# EAGLE design Qwiic Mux (EAGLE 9.6.0)
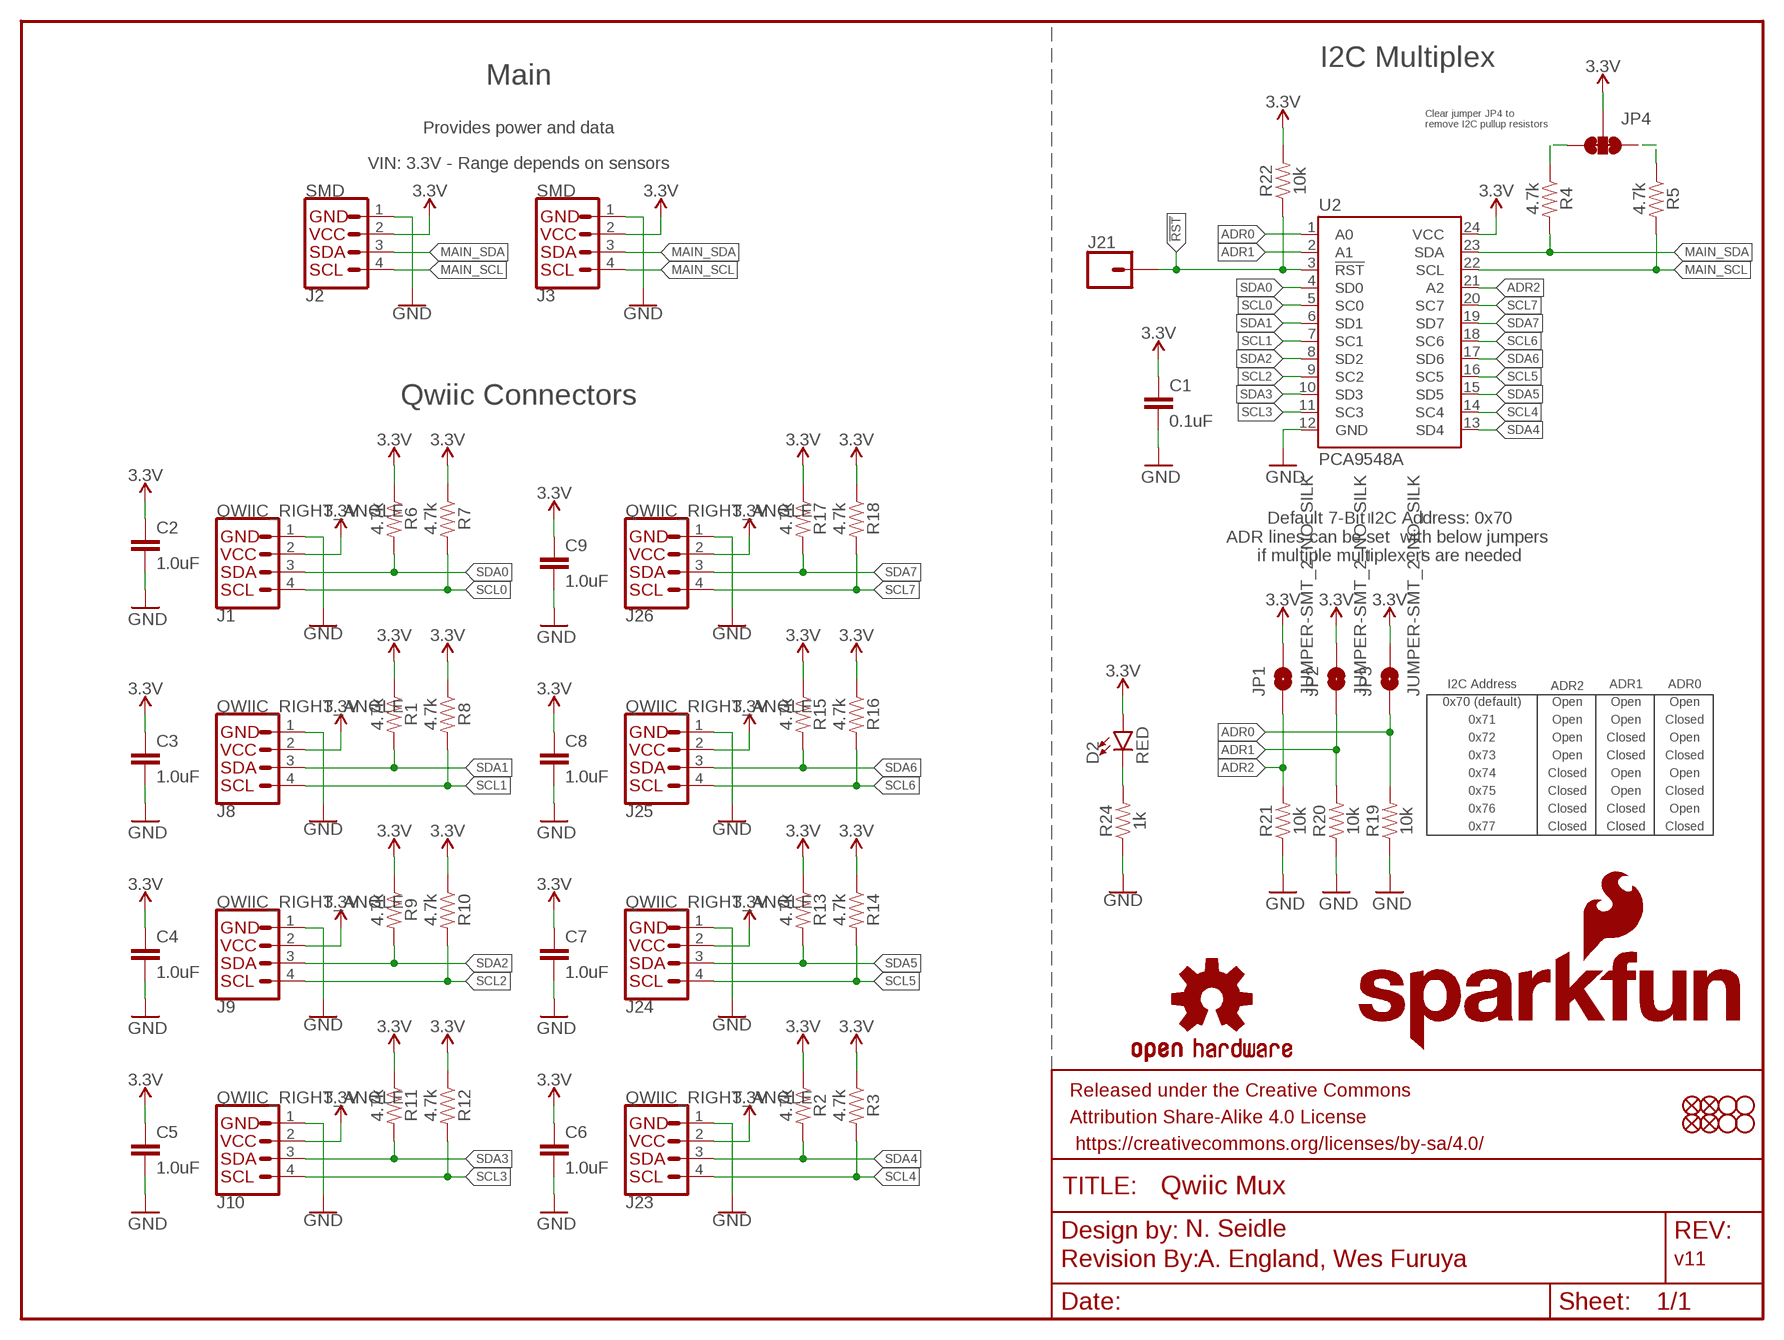
[diagram p0: schematic, sheet 1]

## Parts
C1  0.1uF  0.1UF-0603-25V-(+80/-20%)  [0603]
C2  1.0uF  1.0UF-0603-16V-10%  [0603]
C3  1.0uF  1.0UF-0603-16V-10%  [0603]
C4  1.0uF  1.0UF-0603-16V-10%  [0603]
C5  1.0uF  1.0UF-0603-16V-10%  [0603]
C6  1.0uF  1.0UF-0603-16V-10%  [0603]
C7  1.0uF  1.0UF-0603-16V-10%  [0603]
C8  1.0uF  1.0UF-0603-16V-10%  [0603]
C9  1.0uF  1.0UF-0603-16V-10%  [0603]
D2  RED  LED-RED0603  [LED-0603]
FD1  FIDUCIAL1X2  [FIDUCIAL-1X2]
FD2  FIDUCIAL1X2  [FIDUCIAL-1X2]
FD3  FIDUCIAL1X2  [FIDUCIAL-1X2]
FD4  FIDUCIAL1X2  [FIDUCIAL-1X2]
FRAME1  FRAME-LETTER  [CREATIVE_COMMONS]
H1  STAND-OFF  [STAND-OFF]
H2  STAND-OFF  [STAND-OFF]
H3  STAND-OFF  [STAND-OFF]
H4  STAND-OFF  [STAND-OFF]
J1  QWIIC_RIGHT_ANGLE  QWIIC_CONNECTORJS-1MM  [JST04_1MM_RA]
J2  SMD  I2C_STANDARDJS-1MM  [1X04_1MM_RA]
J3  SMD  I2C_STANDARDJS-1MM  [1X04_1MM_RA]
J8  QWIIC_RIGHT_ANGLE  QWIIC_CONNECTORJS-1MM  [JST04_1MM_RA]
J9  QWIIC_RIGHT_ANGLE  QWIIC_CONNECTORJS-1MM  [JST04_1MM_RA]
J10  QWIIC_RIGHT_ANGLE  QWIIC_CONNECTORJS-1MM  [JST04_1MM_RA]
J21  CONN_01PTH_NO_SILK_YES_STOP  [1X01_NO_SILK]
J23  QWIIC_RIGHT_ANGLE  QWIIC_CONNECTORJS-1MM  [JST04_1MM_RA]
J24  QWIIC_RIGHT_ANGLE  QWIIC_CONNECTORJS-1MM  [JST04_1MM_RA]
J25  QWIIC_RIGHT_ANGLE  QWIIC_CONNECTORJS-1MM  [JST04_1MM_RA]
J26  QWIIC_RIGHT_ANGLE  QWIIC_CONNECTORJS-1MM  [JST04_1MM_RA]
JP1  JUMPER-SMT_2_NO_SILK  [SMT-JUMPER_2_NO_SILK]
JP2  JUMPER-SMT_2_NO_SILK  [SMT-JUMPER_2_NO_SILK]
JP3  JUMPER-SMT_2_NO_SILK  [SMT-JUMPER_2_NO_SILK]
JP4  JUMPER-SMT_3_2-NC_TRACE_SILK  [SMT-JUMPER_3_2-NC_TRACE_SILK]
LOGO1  OSHW-LOGOMINI  [OSHW-LOGO-MINI]
LOGO2  REVISION  [REVISION]
R1  4.7k  4.7KOHM-0603-1/10W-1%  [0603]
R2  4.7k  4.7KOHM-0603-1/10W-1%  [0603]
R3  4.7k  4.7KOHM-0603-1/10W-1%  [0603]
R4  4.7k  4.7KOHM-0603-1/10W-1%  [0603]
R5  4.7k  4.7KOHM-0603-1/10W-1%  [0603]
R6  4.7k  4.7KOHM-0603-1/10W-1%  [0603]
R7  4.7k  4.7KOHM-0603-1/10W-1%  [0603]
R8  4.7k  4.7KOHM-0603-1/10W-1%  [0603]
R9  4.7k  4.7KOHM-0603-1/10W-1%  [0603]
R10  4.7k  4.7KOHM-0603-1/10W-1%  [0603]
R11  4.7k  4.7KOHM-0603-1/10W-1%  [0603]
R12  4.7k  4.7KOHM-0603-1/10W-1%  [0603]
R13  4.7k  4.7KOHM-0603-1/10W-1%  [0603]
R14  4.7k  4.7KOHM-0603-1/10W-1%  [0603]
R15  4.7k  4.7KOHM-0603-1/10W-1%  [0603]
R16  4.7k  4.7KOHM-0603-1/10W-1%  [0603]
R17  4.7k  4.7KOHM-0603-1/10W-1%  [0603]
R18  4.7k  4.7KOHM-0603-1/10W-1%  [0603]
R19  10k  10KOHM-0603-1/10W-1%  [0603]
R20  10k  10KOHM-0603-1/10W-1%  [0603]
R21  10k  10KOHM-0603-1/10W-1%  [0603]
R22  10k  10KOHM-0603-1/10W-1%  [0603]
R24  1k  1KOHM-0603-1/10W-1%  [0603]
U2  PCA9548A  [TSSOP28]
U$1  SFE_LOGO_NAME_FLAME.1_INCH  [SFE_LOGO_NAME_FLAME_.1]
U$2  SFE_LOGO_NAME_FLAME.1_INCH  [SFE_LOGO_NAME_FLAME_.1]

## Nets
3.3V: C1.1 C2.1 C3.1 C4.1 C5.1 C6.1 C7.1 C8.1 C9.1 D2.A J1.2 J2.2(VCC) J3.2(VCC) J8.2 J9.2 J10.2 J23.2 J24.2 J25.2 J26.2 JP1.2 JP2.2 JP3.2 JP4.2 R1.1 R2.1 R3.1 R6.1 R7.1 R8.1 R9.1 R10.1 R11.1 R12.1 R13.1 R14.1 R15.1 R16.1 R17.1 R18.1 R22.2 U2.24(VCC)
!RST: J21.1 R22.1 U2.3(!RST)
ADR0: JP3.1 R19.2 U2.1(A0)
ADR1: JP2.1 R20.2 U2.2(A1)
ADR2: JP1.1 R21.2 U2.21(A2)
GND [vcc]: C1.2 C2.2 C3.2 C4.2 C5.2 C6.2 C7.2 C8.2 C9.2 J1.1 J2.1(GND) J3.1(GND) J8.1 J9.1 J10.1 J23.1 J24.1 J25.1 J26.1 R19.1 R20.1 R21.1 R24.1 U2.12(GND)
MAIN_SCL: J2.4(SCL) J3.4(SCL) R5.2 U2.22(SCL)
MAIN_SDA: J2.3(SDA) J3.3(SDA) R4.2 U2.23(SDA)
N$1: D2.C R24.2
N$2: JP4.3 R4.1
N$3: JP4.1 R5.1
SCL0: J1.4 R7.2 U2.5(SC0)
SCL1: J8.4 R8.2 U2.7(SC1)
SCL2: J9.4 R10.2 U2.9(SC2)
SCL3: J10.4 R12.2 U2.11(SC3)
SCL4: J23.4 R3.2 U2.14(SC4)
SCL5: J24.4 R14.2 U2.16(SC5)
SCL6: J25.4 R16.2 U2.18(SC6)
SCL7: J26.4 R18.2 U2.20(SC7)
SDA0: J1.3 R6.2 U2.4(SD0)
SDA1: J8.3 R1.2 U2.6(SD1)
SDA2: J9.3 R9.2 U2.8(SD2)
SDA3: J10.3 R11.2 U2.10(SD3)
SDA4: J23.3 R2.2 U2.13(SD4)
SDA5: J24.3 R13.2 U2.15(SD5)
SDA6: J25.3 R15.2 U2.17(SD6)
SDA7: J26.3 R17.2 U2.19(SD7)

## Notes on the sheet
- I2C Multiplex
- Main
- Provides power and data
- Clear jumper JP4 to 
  remove I2C pullup resistors
- VIN: 3.3V - Range depends on sensors
- Qwiic Connectors
- Default 7-Bit I2C Address: 0x70
  ADR lines can be set  with below jumpers 
  if multiple multiplexers are needed
- I2C Address | ADR2 | ADR1 | ADR0
- 0x70 (default) | Open | Open | Open
- 0x71 | Open | Open | Closed
- 0x72 | Open | Closed | Open
- 0x73 | Open | Closed | Closed
- 0x74 | Closed | Open | Open
- 0x75 | Closed | Open | Closed
- 0x76 | Closed | Closed | Open
- 0x77 | Closed | Closed | Closed
- N. Seidle
- A. England, Wes Furuya | v11

## Library data of the parts
C1 = SparkFun-Capacitors:0.1UF: 0.1µF ceramic capacitors A capacitor is a passive two-terminal electrical component used to store electrical energy temporarily in an electric field.; PROD_ID: CAP-00810
C2-C9 = SparkFun-Capacitors:1.0UF: 1µF ceramic capacitors A capacitor is a passive two-terminal electrical component used to store electrical energy temporarily in an electric field.; PROD_ID: CAP-00868
D2 = SparkFun-LED:LED-RED: Red SMD LED Used in manufacturing of most products at SparkFun Packages: 0603 - SMD 0603 package [Product Link] <http://docs.avagotech.com/docs/AV02-0551EN> 0603 SMART - SMD 0603 SMART package ( more efficient and expensive)[Product Link] <http://www.osram-os.com/Graphics/XPic2/00077099_0.pdf> 1206 - SMD1206 package [Product Link] <https://www.sparkfun.com/datasheets/DevTools/LilyPad/Q150OVS4.pdff> SparkFun Products: Pro Mini 328 -5V <https://www.sparkfun.com/products/821> RedBoard <https://www.sparkfun.com/products/12757> IOIO-OTG <https://www.sparkfun.com/products/13613>; PROD_ID: DIO-00819
FD1-FD4 = SparkFun-Aesthetics:FIDUCIAL: Fiducial Alignment Points Point-of-reference for pick-and-place machines and other optical instruments.
FRAME1 = SparkFun-Aesthetics:FRAME-LETTER: Schematic Frame - Letter Standard 8.5x11 US Letter frame
H1-H4 = SparkFun-Hardware:STAND-OFF: Stand Off Drill holes for mechanically mounting via screws, standoffs, etc. Note: Use the keepout ring to avoid running the screw head into surrounding components. Variant Overviews STAND-OFF - Mechanical footprint for a #4 phillips button head screw. STAND-OFF-TIGHT - Mechanical footprint for a #4 phillips button head screw, Example SparkFun Products Screw - Phillips Head (1/4", 4-40, 10 pack) <https://www.sparkfun.com/products/10453> (PRT-10453) Screw - Phillips Head (1/2", 4-40, 10 pack) <https://www.sparkfun.com/products/10452> (PRT-10452) Screw - Phillips Head (3/4", 4-40, 10 pack) <https://www.sparkfun.com/products/10451> (PRT-10451) Screw - Phillips Head (1", 4-40, 10 pack) <https://www.sparkfun.com/products/10450> (PRT-10450)
J1 J8-J10 J23-J26 = SparkFun-Connectors:QWIIC_CONNECTOR: SparkFun I2C Standard Qwiic Connector An SMD 1mm pitch JST connector makes it easy and quick (get it? Qwiic?) to connect I2C devices to each other. The Qwiic system <http://www.sparkfun.com/qwiic> enables fast and solderless connection between popular platforms and various sensors and actuators. We carry 200mm <https://www.sparkfun.com/products/14204>, 100mm <https://www.sparkfun.com/products/14205>, 50mm <https://www.sparkfun.com/products/14206>, and breadboard friendly <https://www.sparkfun.com/products/14207> Qwiic cables. We also offer 10 pcs strips <https://www.sparkfun.com/products/14323> the SMD connectors.; PROD_ID: CONN-13694
J2 J3 = SparkX:I2C_STANDARD: SparkFun I2C Standard Pinout Header SparkFun has standardized on a pinout for all I2C based sensor breakouts. This pinout allows I2C boards to be plugged directly into the headers on Arduino Uno compatible boards, and to be daisy chained easily. Example SparkFun Products: SparkFun Atmospheric Sensor Breakout - BME280 <https://www.sparkfun.com/products/13676> SparkFun Altitude/Pressure Sensor Breakout - MPL3115A2 <https://www.sparkfun.com/products/11084> SparkFun TOF Range Finder Sensor - VL6180 <https://www.sparkfun.com/products/12785>
J21 = SparkFun-Connectors:CONN_01: Single connection point. Often used as Generic Header-pin footprint for 0.1 inch spaced/style header connections On any of the 0.1 inch spaced packages, you can populate with these: Break Away Headers - Straight <https://www.sparkfun.com/products/116> (PRT-00116) Break Away Male Headers - Right Angle <https://www.sparkfun.com/products/553> (PRT-00553) Female Headers <https://www.sparkfun.com/products/115> (PRT-00115) Break Away Headers - Machine Pin <https://www.sparkfun.com/products/117> (PRT-00117) Break Away Female Headers - Swiss Machine Pin <https://www.sparkfun.com/products/743> (PRT-00743) This device is also useful as a general connection point to wire up your design to another part of your project. Our various solder wires solder well into these plated through hole pads. Hook-Up Wire - Assortment (Stranded, 22 AWG) <https://www.sparkfun.com/products/11375> (PRT-11375) Hook-Up Wire - Assortment (Solid Core, 22 AWG) <https://www.sparkfun.com/products/11367> (PRT-11367) View the entire wire category on our website here <https://www.sparkfun.com/categories/141> Special notes: SMTSO-256-ET is a "flush mount" nut for a 4-40 screw. We mostly use this on specialty testbeds; it is a nice way to connect hardware to your PCB at an adjustable hieght. Also note, the SNAP packages are for using a snappable style connector. We sell a baggie of snaps and they are also used on two LilyPad designs: Snap Assortment - 30 pack (male and female) <https://www.sparkfun.com/products/11347> (DEV-11347) LilyPad Arduino SimpleSnap <https://www.sparkfun.com/products/10941> (DEV-10941) LilyPad SimpleSnap Protoboard <https://www.sparkfun.com/products/10940> (DEV-10940)
JP1-JP3 = SparkFun-Jumpers:JUMPER-SMT_2_NO: Normally open jumper This jumper has two pads in close proximity to each other. Apply solder to close the connection. Round pads are easier to solder for beginners, but are a lot larger. SparkFun Product that uses the round pads: SparkFun EL Sequencer <https://www.sparkfun.com/products/12781>
JP4 = SparkFun-Jumpers:JUMPER-SMT_3_2-NC_TRACE: Normally closed trace jumper (2 of 2 connections) This jumper has a trace between all three pads so they are normally closed (NC). Use a razor knife to open the connection(s). For best results follow the IPC guidelines for cutting traces: Cutout at least 0.063 mm (0.005 in). Remove all loose material to clean up the cut area. Seal the cut with an approved epoxy. Reapply solder to reclose the connection(s).
LOGO1 = SparkFun-Aesthetics:OSHW-LOGO: Open-Source Hardware (OSHW) Logo This logo indicates the piece of hardware it is found on incorporates a OSHW license and/or adheres to the definition of open source hardware found here: http://freedomdefined.org/OSHW
LOGO2 = SparkFun-Aesthetics:REVISION: "Revision By" Text Preceding text for revisor documentation. Includes schematic text on "symbols" layer, and board text on tDoc.
R1-R18 = SparkFun-Resistors:4.7KOHM: 4.7kΩ resistor A resistor is a passive two-terminal electrical component that implements electrical resistance as a circuit element. Resistors act to reduce current flow, and, at the same time, act to lower voltage levels within circuits. - Wikipedia; PROD_ID: RES-07857
R19-R22 = SparkFun-Resistors:10KOHM: 10kΩ resistor A resistor is a passive two-terminal electrical component that implements electrical resistance as a circuit element. Resistors act to reduce current flow, and, at the same time, act to lower voltage levels within circuits. - Wikipedia; PROD_ID: RES-00824
R24 = SparkFun-Resistors:1KOHM: 1kΩ resistor A resistor is a passive two-terminal electrical component that implements electrical resistance as a circuit element. Resistors act to reduce current flow, and, at the same time, act to lower voltage levels within circuits. - Wikipedia; PROD_ID: RES-07856
U2 = SparkFun-IC-Logic:PCA9548A: Texas Instruments PCA9548A - I2C Multiplexer The PCA9548A device has eight bidirectional translating switches that can be controlled through the I2C bus. The SCL/SDA upstream pair fans out to eight downstream pairs, or channels. Any individual SCn/SDn channel or combination of channels can be selected, determined by the contents of the programmable control register. These downstream channels can be used to resolve I2C slave address conflicts.; PROD_ID: IC-13948
U$1 U$2 = SparkFun-Aesthetics:SFE_LOGO_NAME_FLAME: SparkFun Font Logo w/ Flame This is the SparkFun full logo. The logo on the schematic will always be the same size; the package variant is the height of the flame part of the logo. Default layer for the logo on the board is tSilk.

## Net classes
0 Default: width 0.178 mm
1 vcc: width 0.178 mm

## Board
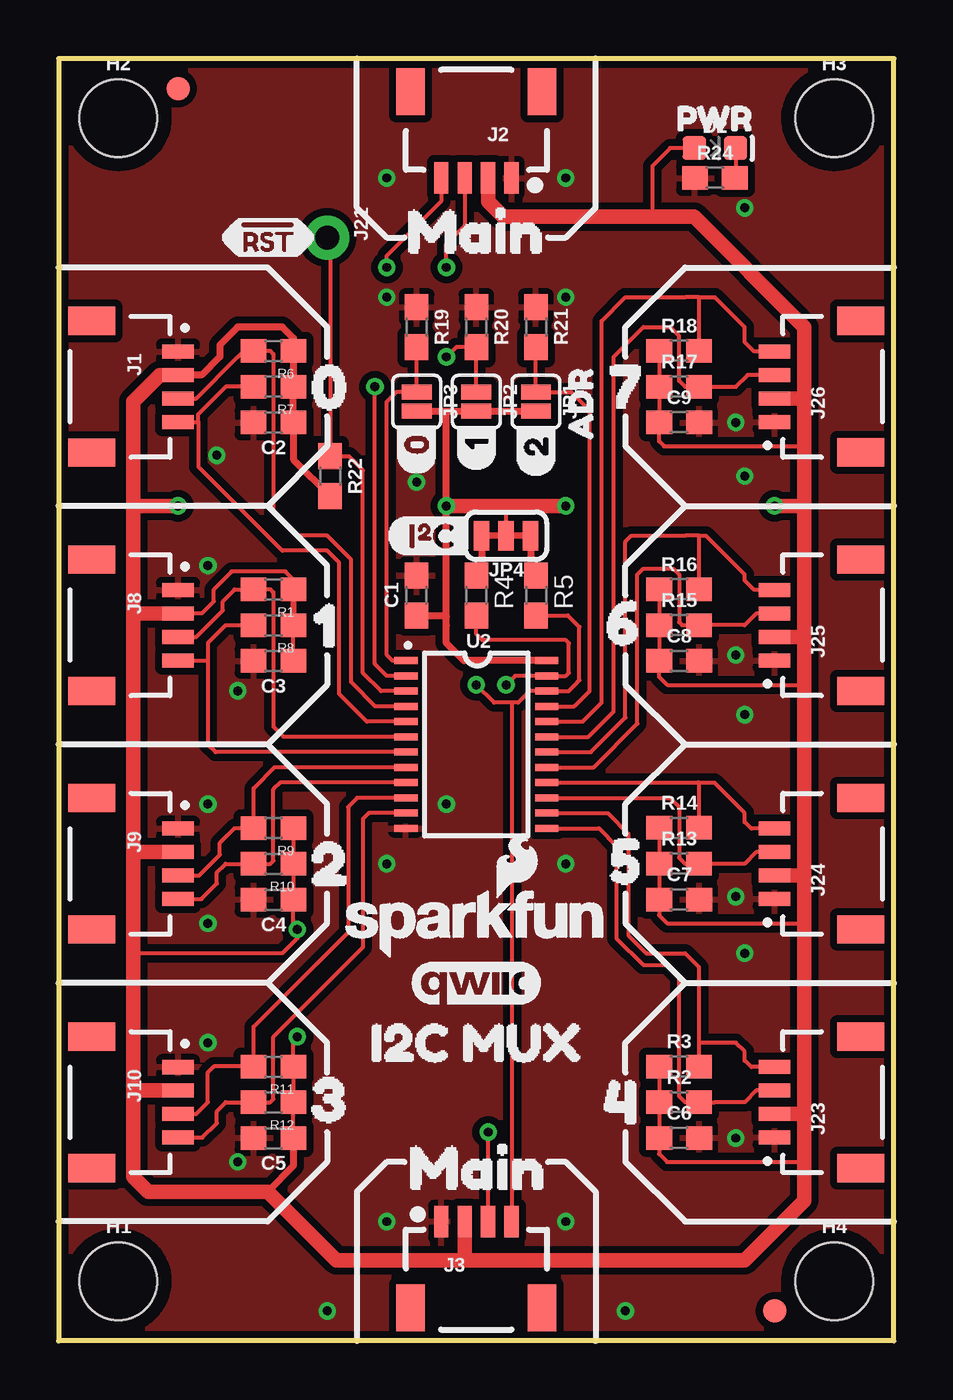
[diagram p1: board, top side]
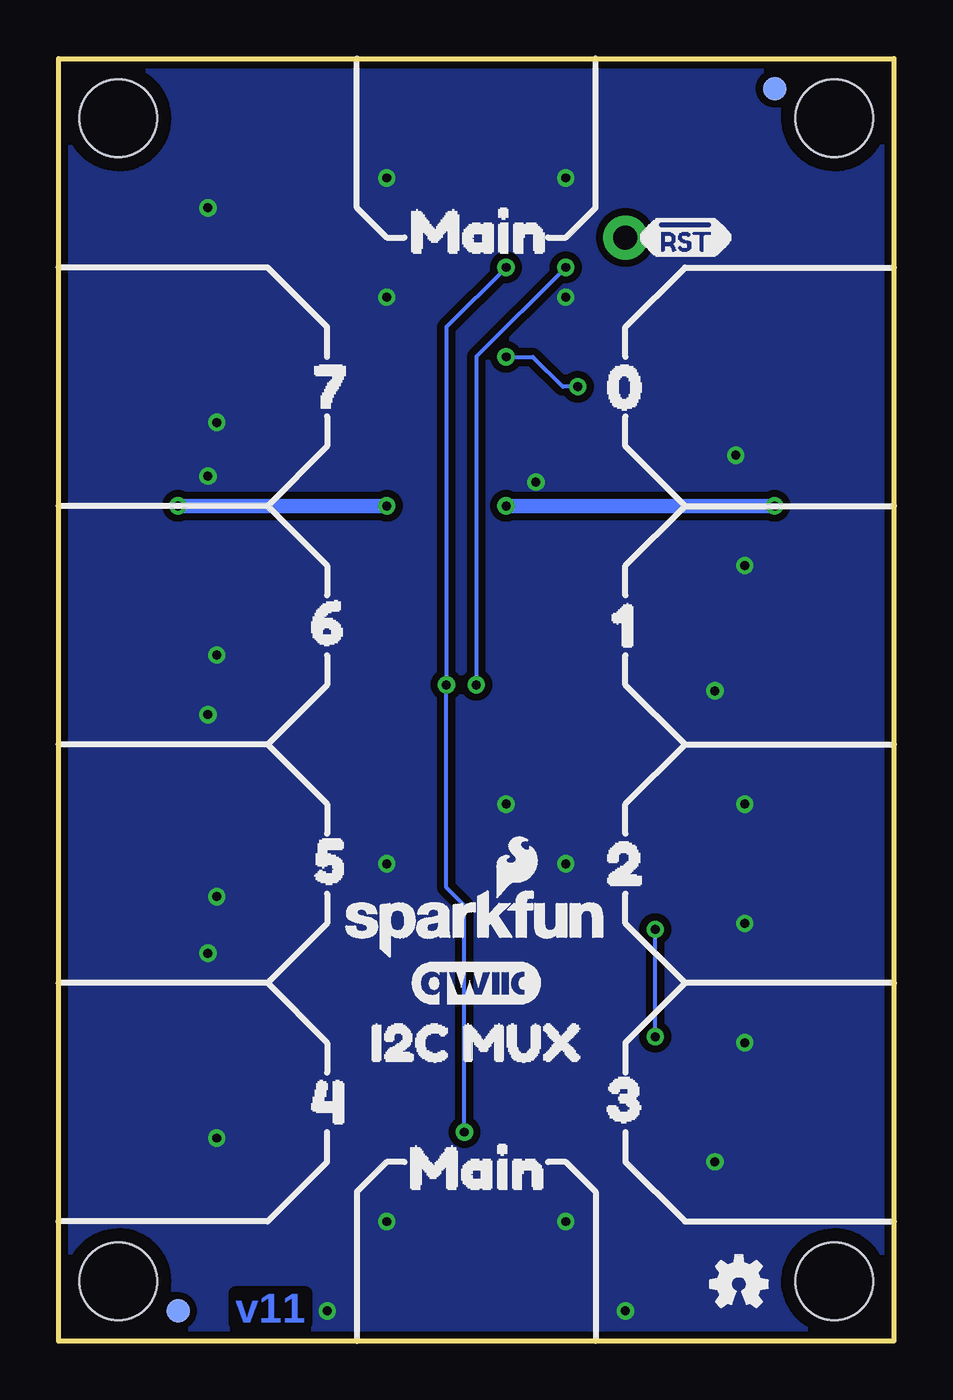
[diagram p2: board, bottom side, seen from below]

Size 35.56 x 54.61 mm. Coordinates in mm from the lower left corner, seen from the top.
Outline: 0,54.61 0,0 35.56,0 35.56,54.61 0,54.61
Copper layers (1*16): Top 0.035mm / dielectric 1.5mm / Bottom 0.035mm
Design rules "SparkFun-2-layer-TIGHT *": minimum track width 7mil, minimum drill 15mil, track to track 6mil, track to pad 6mil, pad to pad 6mil, via to via 6mil, smd to smd 6mil, copper to edge 7mil, drill to drill 7mil, minimum pad ring 7mil, minimum via ring 7mil, stop-mask expansion 4mil, vias tented up to drill 25mil, thermal gap 10mil

### Footprints (pad centres in the part's own frame; a part is rotated, then mirrored left to right if it is on the bottom)
0603 = smd 1.1 x 1: 1 -0.85,0; 2 0.85,0
LED-0603 = smd 1 x 1: A -0.877,0; C 0.877,0
FIDUCIAL-1X2 = smd 1 x 1: 1 0,0
STAND-OFF = hole 3.302: 0,0
JST04_1MM_RA = smd 0.6 x 1.35: 1 -1.5,0; 2 -0.5,0; 3 0.5,0; 4 1.5,0 | smd 1.2 x 2: NC1 2.8,-3.675; NC2 -2.8,-3.675
1X04_1MM_RA = smd 0.6 x 1.35: 1 -1.5,0; 2 -0.5,0; 3 0.5,0; 4 1.5,0 | smd 1.2 x 2: NC1 2.8,-3.675; NC2 -2.8,-3.675
1X01_NO_SILK = drill 1.016 pad 1.88: 1 0,0
SMT-JUMPER_2_NO_SILK = smd 0.635 x 1.27: 1 -0.406,0; 2 0.406,0
SMT-JUMPER_3_2-NC_TRACE_SILK = smd 0.66 x 1.27: 1 -1.041,0; 2 0,0; 3 1.041,0
TSSOP28 = smd 1 x 0.3: 1 -3,3.57; 2 -3,2.925; 3 -3,2.275; 4 -3,1.625; 5 -3,0.975; 6 -3,0.325; 7 -3,-0.325; 8 -3,-0.975; 9 -3,-1.625; 10 -3,-2.275; 11 -3,-2.925; 12 -3,-3.575; 13 3,-3.575; 14 3,-2.925; 15 3,-2.275; 16 3,-1.625; 17 3,-0.975; 18 3,-0.325; 19 3,0.325; 20 3,0.975; 21 3,1.625; 22 3,2.275; 23 3,2.925; 24 3,3.575

### Placement (x,y rotation side)
C1  15.24,31.75 90 top
C2  9.14,39.12 180 top
C3  9.14,28.96 180 top
C4  9.14,18.8 180 top
C5  9.14,8.64 180 top
C6  26.42,8.64 0 top
C7  26.42,18.8 0 top
C8  26.42,28.96 0 top
C9  26.42,39.12 0 top
D2  27.94,50.8 0 top
FD1  5.08,53.34 180 top
FD2  30.48,1.27 180 top
FD3  30.48,1.27 0 bottom
FD4  5.08,53.34 0 bottom
FRAME1  -8.89,-8.89 0 top  (outside the outline)
H1  2.54,2.54 0 top
H2  2.54,52.07 0 top
H3  33.02,52.07 0 top
H4  33.02,2.54 0 top
J1  5.08,40.64 270 top
J2  17.78,49.53 180 top
J3  17.78,5.08 0 top
J8  5.08,30.48 270 top
J9  5.08,20.32 270 top
J10  5.08,10.16 270 top
J21  11.43,46.99 270 top
J23  30.48,10.16 90 top
J24  30.48,20.32 90 top
J25  30.48,30.48 90 top
J26  30.48,40.64 90 top
JP1  20.32,40 270 top
JP2  17.78,40 270 top
JP3  15.24,40 270 top
JP4  19.05,34.29 180 top
LOGO1  6.6,2.43 0 bottom
LOGO2  2.54,-11.43 0 top  (outside the outline)
R1  9.14,32 180 top
R2  26.42,10.16 0 top
R3  26.42,11.68 0 top
R4  17.78,31.75 270 top
R5  20.32,31.75 270 top
R6  9.14,42.16 180 top
R7  9.14,40.64 180 top
R8  9.14,30.48 180 top
R9  9.14,21.84 180 top
R10  9.14,20.32 180 top
R11  9.14,11.68 180 top
R12  9.14,10.16 180 top
R13  26.42,20.32 0 top
R14  26.42,21.84 0 top
R15  26.42,30.48 0 top
R16  26.42,32 0 top
R17  26.42,40.64 0 top
R18  26.42,42.16 0 top
R19  15.24,43.18 270 top
R20  17.78,43.18 270 top
R21  20.32,43.18 270 top
R22  11.56,36.83 270 top
R24  27.94,49.53 0 top
U2  17.78,25.4 0 top
U$1  17.78,17.78 0 top
U$2  17.78,17.78 0 bottom
U$3  [I2C_MUX8]  23.62,12.7 0 bottom
U$4  [QWIIC_5.5MM]  17.78,15.24 0 top
U$5  [04]  15.24,36.83 90 top
U$6  [00]  8.89,40.64 0 top
U$7  [11]  8.89,30.48 0 top
U$8  [22]  8.89,20.32 0 top
U$9  [33]  9.14,10.29 0 top
U$10  [44]  21.59,10.16 0 top
U$11  [55]  21.84,20.45 0 top
U$12  [00]  14.1,40.64 0 bottom
U$13  [77]  21.84,40.64 0 top
U$14  [!RST_I]  6.73,46.99 0 top
U$15  [I2C_MUX8]  11.94,12.7 0 top
U$16  [MAIN0]  13.21,47.24 0 top
U$17  [61]  21.72,30.61 0 top
U$18  [11]  13.97,30.48 0 bottom
U$19  [22]  14.1,20.32 0 bottom
U$20  [33]  13.84,10.29 0 bottom
U$21  [44]  26.42,10.16 0 bottom
U$22  [55]  26.29,20.45 0 bottom
U$23  [61]  26.42,30.61 0 bottom
U$24  [77]  26.29,40.64 0 bottom
U$25  [MAIN0]  22.23,47.24 0 bottom
U$26  [!RST_I]  11.05,46.99 0 bottom
U$27  [MAIN0]  13.28,7.37 0 top
U$28  [MAIN0]  22.28,7.37 0 bottom
U$31  [PWR_TO]  25.4,52.07 0 top
U$32  [15]  17.78,36.83 90 top
U$33  [26]  20.32,36.58 90 top
U$34  [ADR3]  22.23,37.47 90 top
U$35  [I#C6]  13.97,34.29 0 top
U$36  [QWIIC_5.5MM]  17.78,15.24 0 bottom

### Tracks (layer width: path | path; a pad name or v marks a point on that pad's centre or on a via)
3.3V  (via drill 0.38)
  Top 0.178: C3.1 R8.1 | R1.1 9.99,32.42 9.65,32.77 7.37,32.77 6.6,32 6.6,31.5 6.1,30.99 J8.2 | 31.75,38.1 25.78,38.1 25.57,38.31 C9.1 | 31.75,27.94 25.91,27.94 25.57,28.28 C8.1 | J25.2 | R18.1 R17.1 C9.1 | R16.1 R15.1 C8.1 | 25.57,8.89 R2.1 R3.1 | 31.75,17.78 25.91,17.78 25.57,18.12 C7.1 R13.1 | C5.1 R12.1 R11.1 9.99,12.79 v10.16,12.95 | J10.2 | R9.1 R10.1 C4.1 9.99,17.69 v10.16,17.53 10.16,17.14 9.53,16.51 3.17,16.51 | R14.1 R13.1 | R13.1 | 25.57,8.89 | 25.57,8.89 C6.1 25.57,7.96 25.91,7.62 31.75,7.62 | JP4.2 19.05,35.56 | C8.1 | C9.1 | D2.A 26.04,50.8 25.27,50.04 25.27,47.88 | 16.51,30.48
  Top 0.254: R1.1 R8.1
  Top 0.305: JP3.2 16.51,39.6 | 16.51,39.6 JP2.2 JP1.2 | v16.51,35.56 16.51,39.6 | U2.24 17.25,28.97 16.51,29.72 16.51,30.48 16.51,30.86 | J1.2 6.09,41.14 6.86,41.91 6.86,42.42 7.62,43.18 9.53,43.18 9.99,42.71 R6.1 R7.1 C2.1 9.99,37.54 R22.2 | C5.1 9.99,7.45 8.89,6.35 | 17.28,3.44 17.27,3.43 | 16.51,30.86 v16.51,35.56 | v16.51,35.56 | C1.1 16.47,30.9 16.51,30.86
  Top 0.61: 31.75,9.66 31.75,7.62 31.75,5.97 29.21,3.43 17.27,3.43 11.81,3.43 8.89,6.35 3.81,6.35 3.17,6.99 3.17,10.67 | 31.75,9.66 31.75,17.78 31.75,19.82 | 31.75,19.82 31.75,27.94 31.75,29.97 | 31.75,29.97 31.75,35.56 | 31.75,35.56 31.75,38.1 31.75,40.13 | 31.75,29.97 J25.2 | J24.2 31.75,19.82 | v30.48,35.56 31.75,35.56 | J1.2 4.31,41.14 3.17,40.01 3.17,35.56 | 3.17,35.56 3.17,30.98 | 3.17,30.98 3.17,20.82 | 3.17,20.82 3.17,16.51 3.17,10.67 | 3.17,10.67 J10.2 | J9.2 3.17,20.82 | J8.2 3.17,30.98 | J23.2 31.75,9.66 | 31.75,40.13 31.75,43.18 27.05,47.88 25.27,47.88 18.92,47.88 18.28,48.52 J2.2 | v16.51,35.56 19.05,35.56 v21.59,35.56 | J3.2 17.28,3.44 | v5.08,35.56 3.17,35.56 | J26.2 31.74,40.14 31.75,40.13
  Bottom 0.178: v10.16,12.95 v10.16,17.53
  Bottom 0.61: v30.48,35.56 v21.59,35.56 | v16.51,35.56 v5.08,35.56
!RST
  Top 0.178: U2.3 13.73,27.67 12.95,28.45 12.95,37.08 12.36,37.68 R22.1 11.56,46.86 J21.1
ADR0
  Top 0.178: R19.2 JP3.1 14.38,40.41 13.97,40 13.97,29.21 14.21,28.97 U2.1
ADR1  (via drill 0.38)
  Top 0.178: JP2.1 R20.2 16.93,42.33 v16.51,41.91 | U2.2 13.97,28.32 13.46,28.83 v13.46,40.64
  Bottom 0.178: v16.51,41.91 15.37,41.91 14.1,40.64 v13.46,40.64
ADR2
  Top 0.178: R21.2 JP1.1 21.82,40.41 22.61,39.62 22.61,27.69 21.94,27.02 U2.21
GND  (via drill 0.38)
  other vias: 6.73,37.72 7.62,27.69 6.35,17.78 7.62,7.62 15.24,36.58 13.97,20.32 21.59,20.32 13.97,44.45 13.97,49.53 21.59,49.53 21.59,44.45 16.51,22.86 28.83,18.92 29.21,36.83 28.83,39.12 28.83,29.21 29.21,26.67 6.35,12.7 6.35,22.86 6.35,33.02 28.83,8.64 13.97,5.08 21.59,5.08 11.43,1.27 24.13,1.27 29.21,16.51 29.21,48.26
  pour Top (isolate 0.305): 0,54.61 35.56,54.61 35.56,0 0,0
  pour Bottom (isolate 0.305): 0,54.61 35.56,54.61 35.56,0 0,0
MAIN_SCL  (via drill 0.38)
  Top 0.178: R5.2 21.68,30.9 22.17,30.4 22.17,28.14 22.1,28.07 21.71,27.67 U2.22 20.05,27.67 19.56,27.18 19.3,27.18 | J2.4 16.28,48.54 13.97,46.23 v13.97,45.72 | 19.3,27.18 18.54,27.18 v17.78,27.94 | J3.4 19.3,5.1 19.3,27.18
  Bottom 0.178: v17.78,27.94 17.78,41.91 v13.97,45.72
MAIN_SDA  (via drill 0.38)
  Top 0.178: R4.2 17.78,30.1 18.03,29.84 21.59,29.84 21.72,29.72 21.72,28.45 21.59,28.32 U2.23 19.43,28.32 v19.05,27.94 | J2.3 17.28,47.51 16.51,46.74 v16.51,45.72 | J3.3 v18.28,8.88 v18.29,8.89
  Bottom 0.178: v16.51,45.72 19.05,43.18 v19.05,27.94 19.05,19.3 18.29,18.54 v18.29,8.89
N$1
  Top 0.178: D2.C 28.82,49.56
  Top 0.254: 28.82,49.56 R24.2
N$2
  Top 0.305: JP4.3 18.01,32.83 R4.1
N$3
  Top 0.305: JP4.1 20.09,32.83 R5.1
SCL0
  Top 0.178: U2.5 13.12,26.37 11.94,27.56 11.94,33.15 11.43,33.66 9.53,33.66 5.95,37.23 5.95,39.14 | R7.2 7.11,40.64 5.95,39.47 5.95,39.14 | J1.4 5.95,39.14
SCL1
  Top 0.178: J8.4 6.35,28.98 | U2.7 6.68,25.07 6.35,25.4 6.35,28.98 | R8.2 7.11,30.48 6.35,29.72 6.35,28.98
SCL2
  Top 0.178: U2.9 9.42,23.77 9.14,23.5 9.14,20.45 9.02,20.32 R10.2 7.11,20.32 6.73,19.94 6.73,19.48 6.07,18.82 J9.4
SCL3
  Top 0.178: U2.11 13.2,22.47 12.95,22.22 12.95,16.76 9.14,12.95 9.14,10.29 9.02,10.16 R12.2 7.11,10.16 6.73,9.78 6.73,9.27 6.12,8.66 J10.4
SCL4
  Top 0.178: U2.14 23.37,22.47 24.26,21.59 24.26,17.27 25.02,16.51 26.67,16.51 27.27,15.91 27.27,12.7 | J23.4 29.49,11.66 29.21,11.94 29.21,12.32 28.83,12.7 27.27,12.7 | R3.2 27.27,12.7
SCL5
  Top 0.178: J24.4 29.49,21.82 29.21,22.1 29.21,22.48 27.91,23.77 27.27,23.77 | U2.16 27.18,23.77 27.27,23.77 | R14.2 27.27,23.77
SCL6
  Top 0.178: J25.4 29.61,31.98 29.21,32.38 29.21,32.64 27.56,34.29 27.27,34.29 | U2.18 22.66,25.07 24.13,26.54 24.13,34.04 24.38,34.29 26.67,34.29 27.27,34.29 | R16.2 27.27,34.29
SCL7
  Top 0.178: U2.20 22.31,26.37 23.11,27.18 23.11,43.43 24.13,44.45 26.67,44.45 27.27,44.45 | J26.4 29.61,42.14 29.21,42.55 29.21,43.18 27.94,44.45 27.27,44.45 | R18.2 27.27,44.45
SDA0
  Top 0.178: U2.4 13.49,27.02 12.45,28.07 12.45,33.27 11.43,34.29 10.16,34.29 9.14,35.31 9.14,42.04 9.02,42.16 R6.2 7.88,42.16 7.62,41.91 5.85,40.14 J1.3
SDA1
  Top 0.178: U2.6 9.58,25.72 9.14,26.16 9.14,31.88 9.02,32 R1.2 7.49,32 6.99,31.5 6.99,31.11 5.85,29.98 J8.3
SDA2
  Top 0.178: U2.8 9.18,24.42 8.29,23.53 R9.2 7.49,21.84 6.86,21.21 6.86,20.7 5.98,19.82 J9.3
SDA3
  Top 0.178: U2.10 12.71,23.12 12.32,22.73 12.32,17.4 8.29,13.37 R11.2 6.6,11.68 6.35,11.43 6.35,10.16 5.85,9.66 J10.3
SDA4
  Top 0.178: U2.13 23.01,21.82 23.75,21.08 23.75,17.14 24.89,16 25.91,16 26.42,15.49 26.42,10.41 26.67,10.16 R2.2 27.94,10.16 29.21,10.16 29.71,10.66 J23.3
SDA5
  Top 0.178: J24.3 29.71,20.82 29.21,20.32 R13.2 26.67,20.32 26.42,20.57 26.42,22.73 26.02,23.12 U2.15
SDA6
  Top 0.178: J25.3 29.71,30.98 29.21,30.48 R15.2 26.54,30.48 26.42,30.61 26.42,32.64 26.16,32.89 24.89,32.89 24.64,32.64 24.64,26.29 22.77,24.42 U2.17
SDA7
  Top 0.178: J26.3 29.33,41.14 28.83,40.64 R17.2 26.67,40.64 26.42,40.89 26.42,42.8 26.04,43.18 24.89,43.18 23.62,41.91 23.62,26.8 22.55,25.72 U2.19

### Text on the board
Bottom: v11
Measures: Measures in Inches
tDocu: N. Seidle | A. England